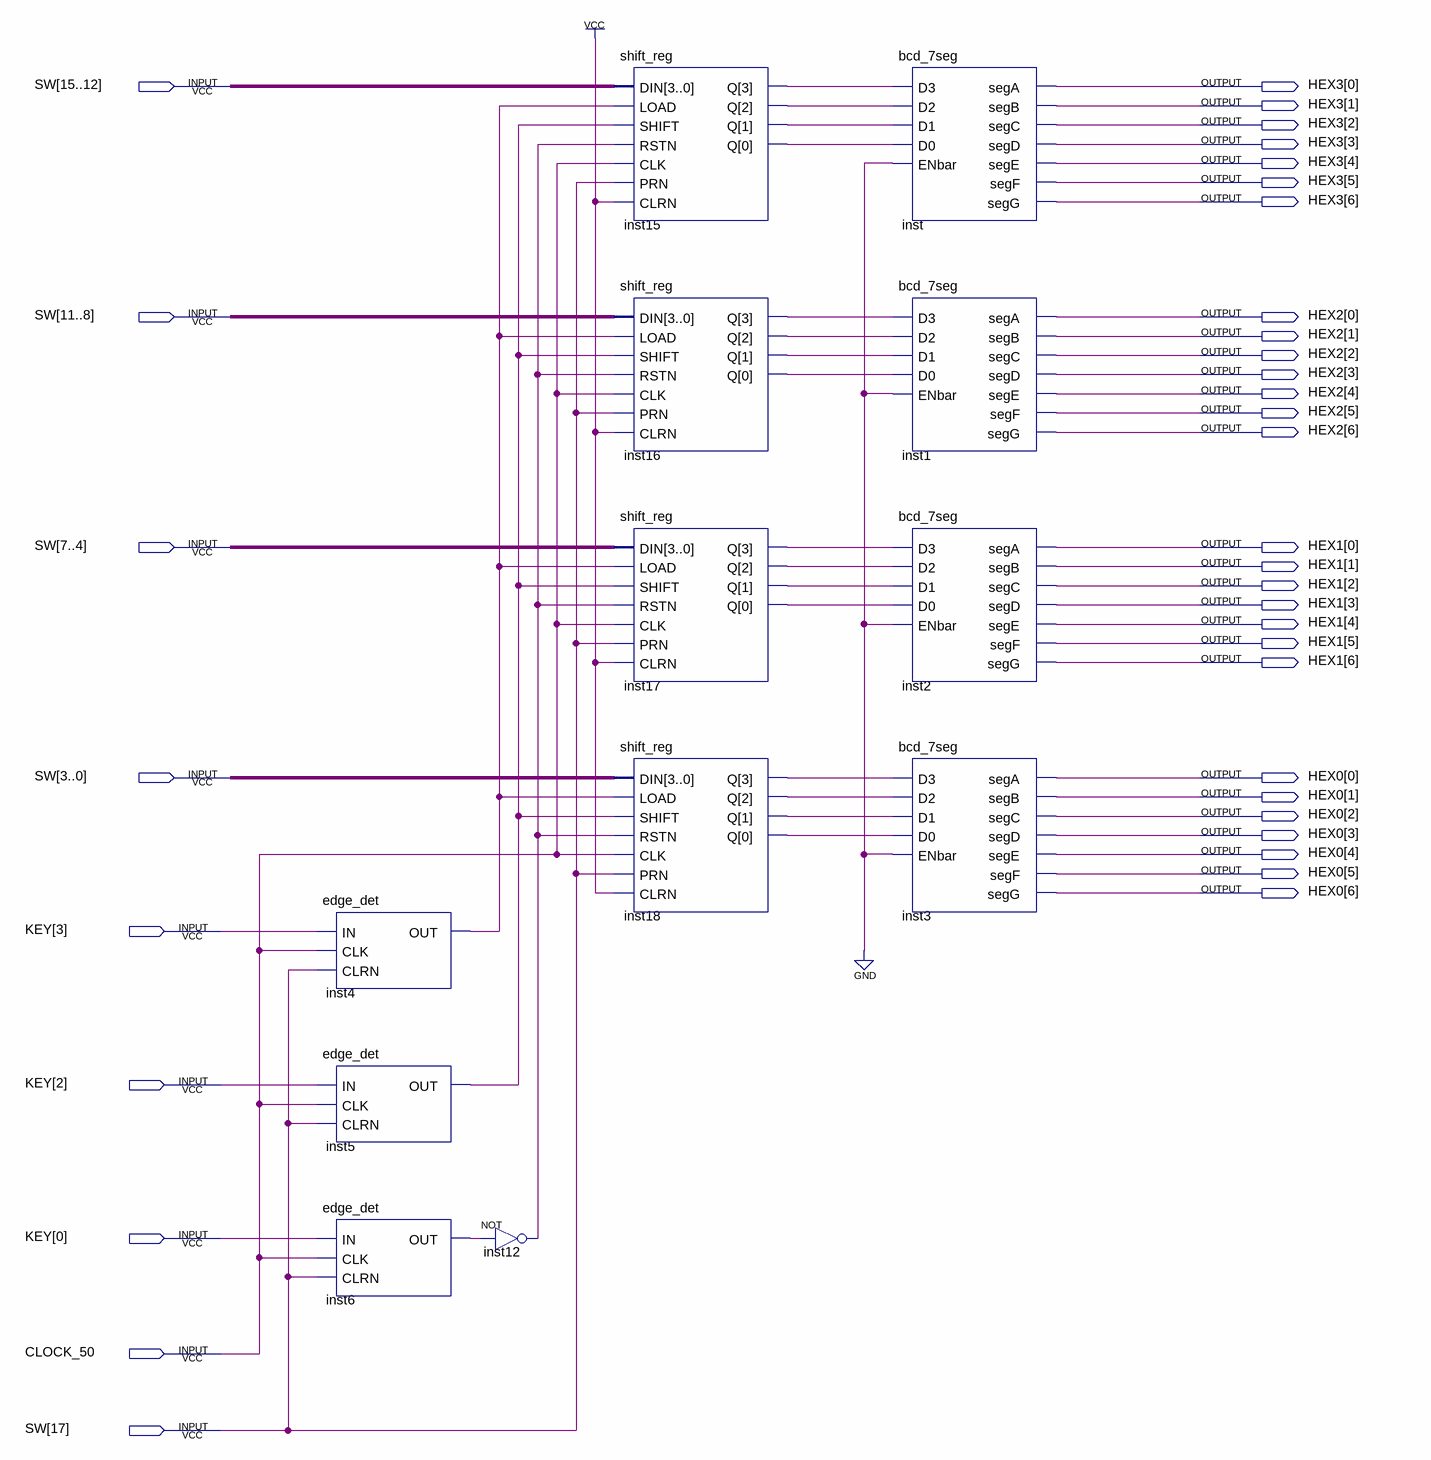
[diagram p0: schematic sheet]
// Quartus schematic Lab5_top_level.bdf as structural Verilog: 12 symbols, 37 pins
module Lab5_top_level (
  input  [17:0] SW,
  input  [3:0] KEY,
  input  CLOCK_50,
  output [6:0] HEX3,
  output [6:0] HEX2,
  output [6:0] HEX1,
  output [6:0] HEX0
);

  wire inst4_out, inst5_out, inst6_out, inst12_out, inst15_q, inst15_q_2, inst15_q_3, inst15_q_4, inst16_q,
       inst16_q_2, inst16_q_3, inst16_q_4, inst17_q, inst17_q_2, inst17_q_3, inst17_q_4, inst18_q,
       inst18_q_2, inst18_q_3, inst18_q_4;

  edge_det inst4 (.IN(KEY[3]), .CLK(CLOCK_50), .CLRN(SW[17]), .OUT(inst4_out));
  edge_det inst5 (.IN(KEY[2]), .CLK(CLOCK_50), .CLRN(SW[17]), .OUT(inst5_out));
  edge_det inst6 (.IN(KEY[0]), .CLK(CLOCK_50), .CLRN(SW[17]), .OUT(inst6_out));
  not inst12 (inst12_out, inst6_out);
  shift_reg inst15 (
    .DIN(SW[15:12]), .LOAD(inst4_out), .SHIFT(inst5_out), .RSTN(inst12_out), .CLK(CLOCK_50), .PRN(SW[17]),
    .CLRN(1'b1), .Q({inst15_q_4, inst15_q_3, inst15_q_2, inst15_q}));
  shift_reg inst16 (
    .DIN(SW[11:8]), .LOAD(inst4_out), .SHIFT(inst5_out), .RSTN(inst12_out), .CLK(CLOCK_50), .PRN(SW[17]),
    .CLRN(1'b1), .Q({inst16_q, inst16_q_2, inst16_q_3, inst16_q_4}));
  shift_reg inst17 (
    .DIN(SW[7:4]), .LOAD(inst4_out), .SHIFT(inst5_out), .RSTN(inst12_out), .CLK(CLOCK_50), .PRN(SW[17]),
    .CLRN(1'b1), .Q({inst17_q, inst17_q_2, inst17_q_3, inst17_q_4}));
  shift_reg inst18 (
    .DIN(SW[3:0]), .LOAD(inst4_out), .SHIFT(inst5_out), .RSTN(inst12_out), .CLK(CLOCK_50), .PRN(SW[17]),
    .CLRN(1'b1), .Q({inst18_q, inst18_q_2, inst18_q_3, inst18_q_4}));
  bcd_7seg inst (
    .D3(inst15_q_4), .D2(inst15_q_3), .D1(inst15_q_2), .D0(inst15_q), .ENbar(1'b0), .segA(HEX3[0]),
    .segB(HEX3[1]), .segC(HEX3[2]), .segD(HEX3[3]), .segE(HEX3[4]), .segF(HEX3[5]), .segG(HEX3[6]));
  bcd_7seg inst1 (
    .D3(inst16_q), .D2(inst16_q_2), .D1(inst16_q_3), .D0(inst16_q_4), .ENbar(1'b0), .segA(HEX2[0]),
    .segB(HEX2[1]), .segC(HEX2[2]), .segD(HEX2[3]), .segE(HEX2[4]), .segF(HEX2[5]), .segG(HEX2[6]));
  bcd_7seg inst2 (
    .D3(inst17_q), .D2(inst17_q_2), .D1(inst17_q_3), .D0(inst17_q_4), .ENbar(1'b0), .segA(HEX1[0]),
    .segB(HEX1[1]), .segC(HEX1[2]), .segD(HEX1[3]), .segE(HEX1[4]), .segF(HEX1[5]), .segG(HEX1[6]));
  bcd_7seg inst3 (
    .D3(inst18_q), .D2(inst18_q_2), .D1(inst18_q_3), .D0(inst18_q_4), .ENbar(1'b0), .segA(HEX0[0]),
    .segB(HEX0[1]), .segC(HEX0[2]), .segD(HEX0[3]), .segE(HEX0[4]), .segF(HEX0[5]), .segG(HEX0[6]));
endmodule
